# EAGLE schematic ESP-WROOM-02-BREAK (EAGLE 6.6.0)
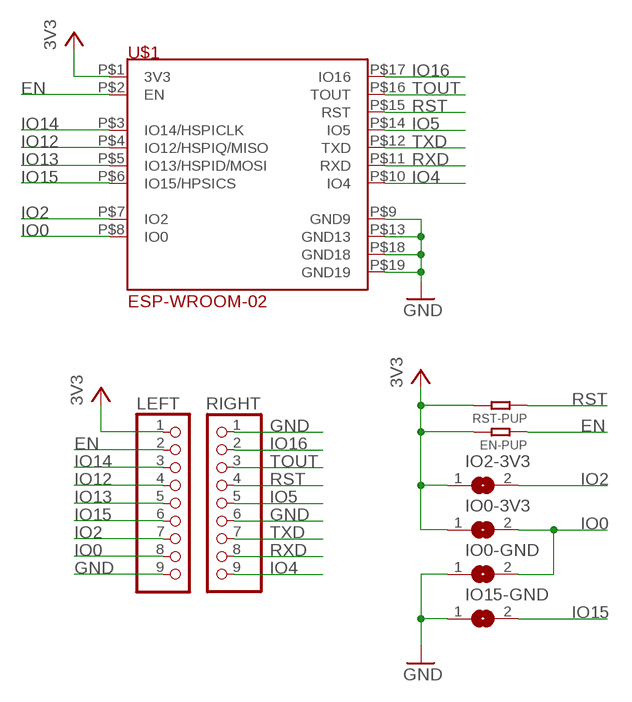
[diagram p0: schematic, sheet 1]

## Parts
EN-PUP  10K  SMD-RES-10K-1%-1/8W(0805)  [R0805]
IO0-3V3  SJ  [SJ]
IO0-GND  SJ  [SJ]
IO2-3V3  SJ  [SJ]
IO15-GND  SJ  [SJ]
LEFT  PINHD-1X9  [1X09]
RIGHT  PINHD-1X9  [1X09]
RST-PUP  10K  SMD-RES-10K-1%-1/8W(0805)  [R0805]
U$1  ESP-WROOM-02  [ESP-WROOM-02]

## Nets
3V3: EN-PUP.2 IO0-3V3.1 IO2-3V3.1 LEFT.1 RST-PUP.2 U$1.P$1(3V3)
EN: EN-PUP.1 LEFT.2 U$1.P$2(EN)
GND: IO0-GND.1 IO15-GND.1 LEFT.9 RIGHT.1 RIGHT.6 U$1.P$9(GND9) U$1.P$13(GND13) U$1.P$18(GND18) U$1.P$19(GND19)
IO0: IO0-3V3.2 IO0-GND.2 LEFT.8 U$1.P$8(IO0)
IO2: IO2-3V3.2 LEFT.7 U$1.P$7(IO2)
IO4: RIGHT.9 U$1.P$10(IO4)
IO5: RIGHT.5 U$1.P$14(IO5)
IO12: LEFT.4 U$1.P$4(IO12/HSPIQ/MISO)
IO13: LEFT.5 U$1.P$5(IO13/HSPID/MOSI)
IO14: LEFT.3 U$1.P$3(IO14/HSPICLK)
IO15: IO15-GND.2 LEFT.6 U$1.P$6(IO15/HPSICS)
IO16: RIGHT.2 U$1.P$17(IO16)
RST: RIGHT.4 RST-PUP.1 U$1.P$15(RST)
RXD: RIGHT.8 U$1.P$11(RXD)
TOUT: RIGHT.3 U$1.P$16(TOUT)
TXD: RIGHT.7 U$1.P$12(TXD)

## Library data of the parts
EN-PUP RST-PUP = Seeed-Resistor:SMD-RES-10K-1%-1/8W(0805): 301010361; MPN: RC0805FR-0710KL
IO0-3V3 IO0-GND IO2-3V3 IO15-GND = jumper:SJ: SMD solder JUMPER
LEFT RIGHT = pinhead:PINHD-1X9: PIN HEADER
U$1 = PCR-Module:ESP-WROOM-02